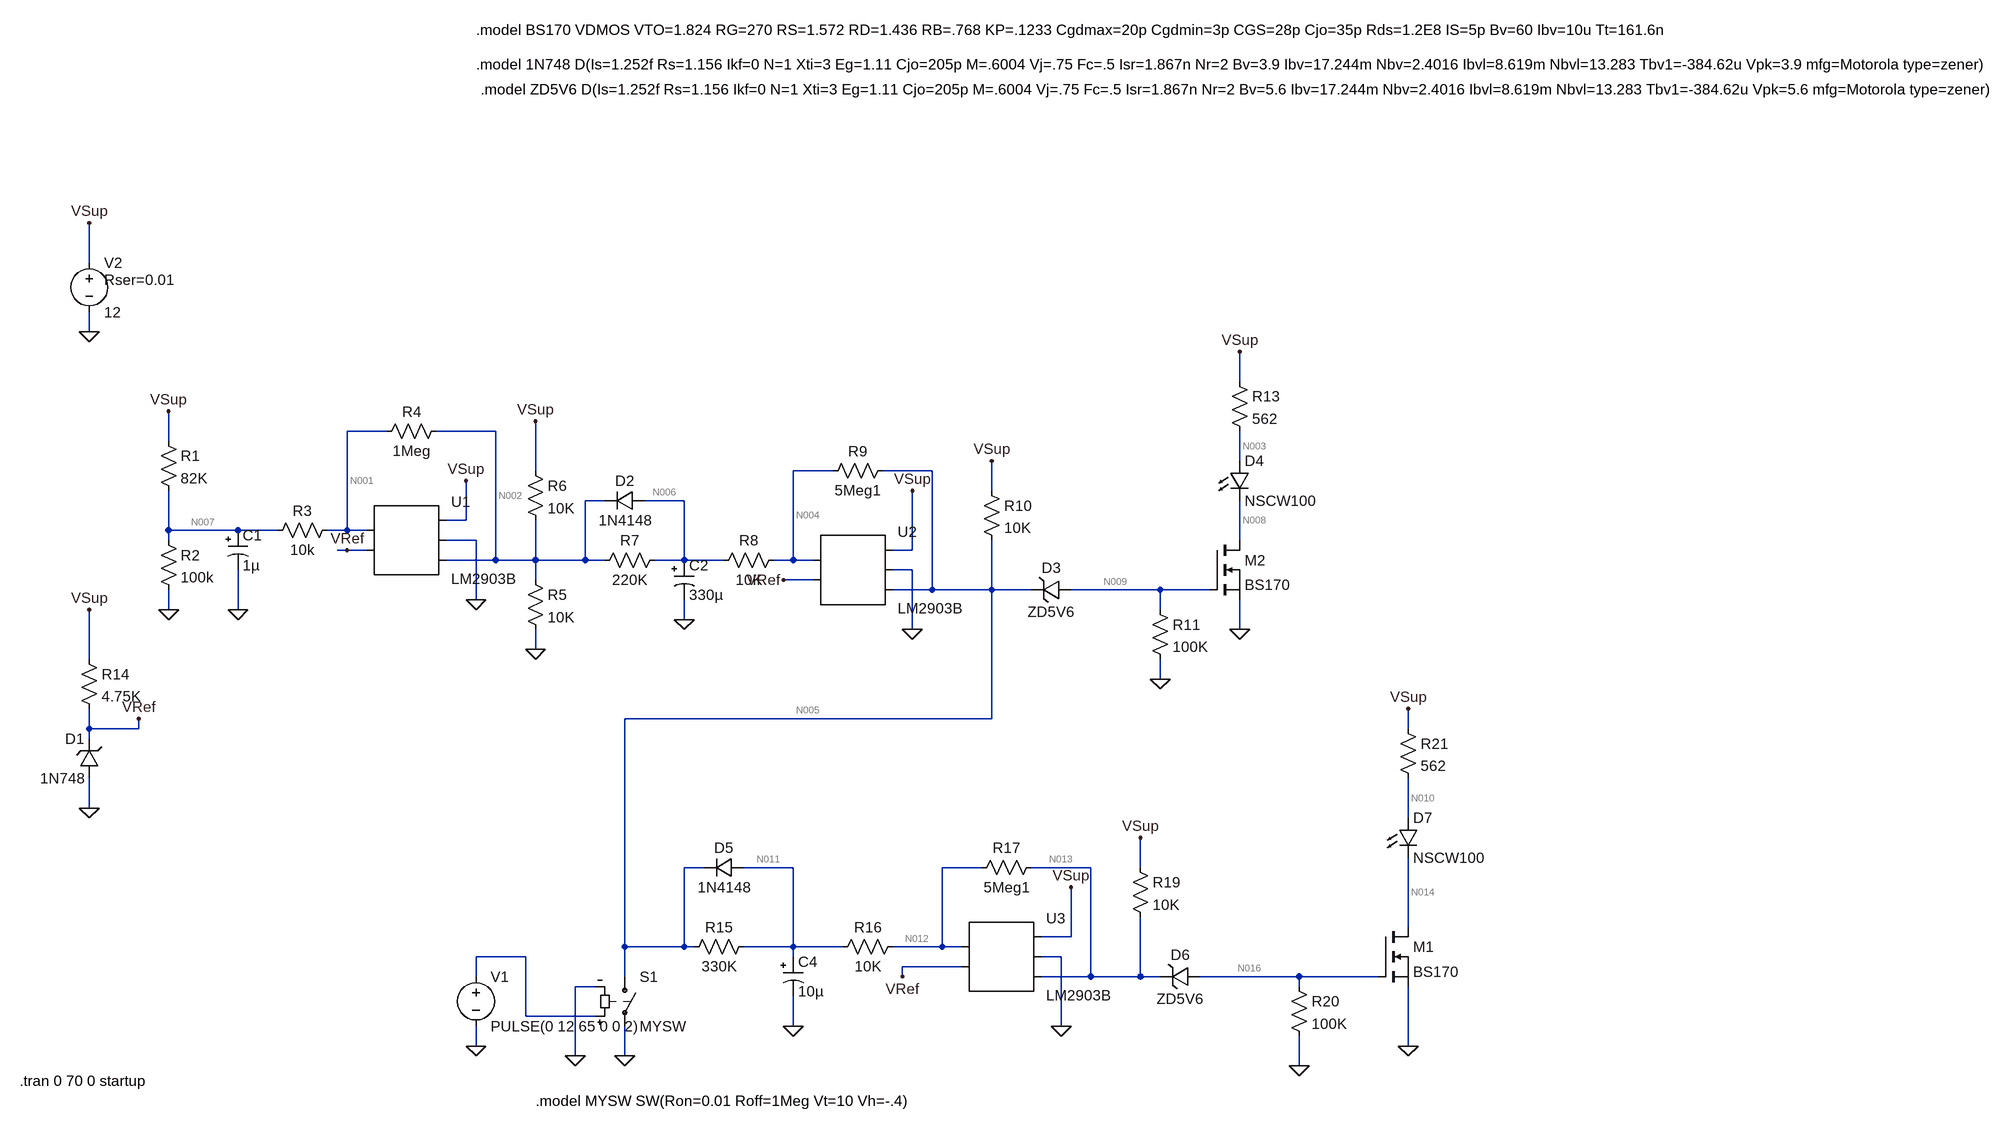
[diagram p0: schematic Delay.asc]
* Delay.asc
* U1: LM2903B (symbol AutoGenerated\LM2903B not available, pins judged from their places): pin1=N001 pin2=VRef pin3=VSup pin4=0 pin5=N002
* U2: LM2903B (symbol AutoGenerated\LM2903B not available, pins judged from their places): pin1=N004 pin2=VRef pin3=VSup pin4=0 pin5=N005
R1 VSup N007 82K tol=1 pwr=0.1
R2 N007 0 100k
C1 N007 0 1µ V=50 Irms=6.2m Rser=2.66795 Lser=851.833p mfg="Würth Elektronik" pn="865230640005 WCAP-AS5H 4x5,5" type="Al electrolytic"
R3 N001 N007 10k
V2 VSup 0 12 Rser=0.01
R4 N002 N001 1Meg tol=1 pwr=0.1
R5 N002 0 10K tol=1 pwr=0.1
R6 VSup N002 10K tol=1 pwr=0.1
R7 N006 N002 220K tol=1 pwr=0.1
C2 N006 0 330µ V=16 Irms=235m Rser=0.36 Lser=0
R8 N004 N006 10K tol=1 pwr=0.1
R9 N005 N004 5Meg1 tol=1 pwr=0.1
R10 VSup N005 10K tol=1 pwr=0.1
D2 N006 N002 1N4148
R13 VSup N003 562 tol=1 pwr=0.1
D4 N003 N008 NSCW100
D1 0 VRef 1N748
R14 VSup VRef 4.75K tol=1 pwr=0.1
* U3: LM2903B (symbol AutoGenerated\LM2903B not available, pins judged from their places): pin1=N012 pin2=VRef pin3=VSup pin4=0 pin5=N013
D5 N011 N005 1N4148
C4 N011 0 10µ V=25 Irms=235m Rser=0.46 Lser=0
R15 N011 N005 330K tol=1 pwr=0.1
R16 N012 N011 10K tol=1 pwr=0.1
R17 N013 N012 5Meg1 tol=1 pwr=0.25
R19 VSup N013 10K tol=1 pwr=0.1
R20 N016 0 100K tol=1 pwr=0.1
D7 N010 N014 NSCW100
R21 VSup N010 562 tol=1 pwr=0.1
M1 N014 N016 0 0 BS170
M2 N008 N009 0 0 BS170
D3 N009 N005 ZD5V6
D6 N016 N013 ZD5V6
R11 N009 0 100K tol=1 pwr=0.1
S1 N005 0 N015 0 MYSW
V1 N015 0 PULSE(0 12 65 0 0 2)
.model D D
.lib standard.dio
.model NMOS NMOS
.model PMOS PMOS
.lib standard.mos
.model BS170 VDMOS VTO=1.824 RG=270 RS=1.572 RD=1.436 RB=.768 KP=.1233 Cgdmax=20p Cgdmin=3p CGS=28p Cjo=35p Rds=1.2E8 IS=5p Bv=60 Ibv=10u Tt=161.6n
.model 1N748 D(Is=1.252f Rs=1.156 Ikf=0 N=1 Xti=3 Eg=1.11 Cjo=205p M=.6004 Vj=.75 Fc=.5 Isr=1.867n Nr=2 Bv=3.9 Ibv=17.244m Nbv=2.4016 Ibvl=8.619m Nbvl=13.283 Tbv1=-384.62u Vpk=3.9 mfg=Motorola type=zener)
.model ZD5V6 D(Is=1.252f Rs=1.156 Ikf=0 N=1 Xti=3 Eg=1.11 Cjo=205p M=.6004 Vj=.75 Fc=.5 Isr=1.867n Nr=2 Bv=5.6 Ibv=17.244m Nbv=2.4016 Ibvl=8.619m Nbvl=13.283 Tbv1=-384.62u Vpk=5.6 mfg=Motorola type=zener)
.tran 0 70 0 startup
.model MYSW SW(Ron=0.01 Roff=1Meg Vt=10 Vh=-.4)
.backanno
.end

* Results of the author's LTspice run, read from the files saved beside the schematic
* Operating Point, zero values left out:
*   V(vsup) = -16.5 µV
*   V(n002) = 114.8 nV
*   V(n001) = 174.1 µV
*   V(vref) = 33.32 µV
*   V(n005) = 109.9 nV
*   V(n004) = 761.8 µV
*   V(n007) = 140.8 µV
*   V(n006) = 728.3 µV
*   V(n003) = -16.5 µV
*   V(n008) = -14.66 µV
*   V(n013) = -88.41 nV
*   V(n012) = 1.097 mV
*   V(n011) = 1.064 mV
*   V(n016) = -336.8 pV
*   V(n010) = -16.5 µV
*   V(n014) = -14.66 µV
*   V(n009) = 418.8 pV
*   I(D1) = -11.03 pA
*   I(D5) = 59.88 pA
*   I(D2) = 40.82 pA
*   I(R19) = -1.641 nA
*   I(R17) = -215.2 pA
*   I(R16) = 3.285 nA
*   I(R15) = 3.225 nA
*   I(R14) = -10.49 nA
*   I(R10) = -1.661 nA
*   I(R9) = -149.3 pA
*   I(R8) = 3.351 nA
*   I(R7) = 3.31 nA
*   I(R6) = -1.661 nA
*   I(R5) = 11.48 pA
*   I(R4) = -173.9 pA
*   I(R3) = 3.326 nA
*   I(R2) = 1.408 nA
*   I(R1) = -1.918 nA
*   I(V2) = -1.65 mA
*   Ix(u1:IN+) = -3.5 nA
*   Ix(u1:IN-) = -3.5 nA
*   Ix(u1:VCC) = 550 µA
*   Ix(u1:GND) = -550 µA
*   Ix(u1:OUT) = 1.852 nA
*   Ix(u2:IN+) = -3.5 nA
*   Ix(u2:IN-) = -3.5 nA
*   Ix(u2:VCC) = 550 µA
*   Ix(u2:GND) = -550 µA
*   Ix(u2:OUT) = 1.773 nA
*   Ix(u3:IN+) = -3.5 nA
*   Ix(u3:IN-) = -3.5 nA
*   Ix(u3:VCC) = 550 µA
*   Ix(u3:GND) = -550 µA
*   Ix(u3:OUT) = -1.426 nA
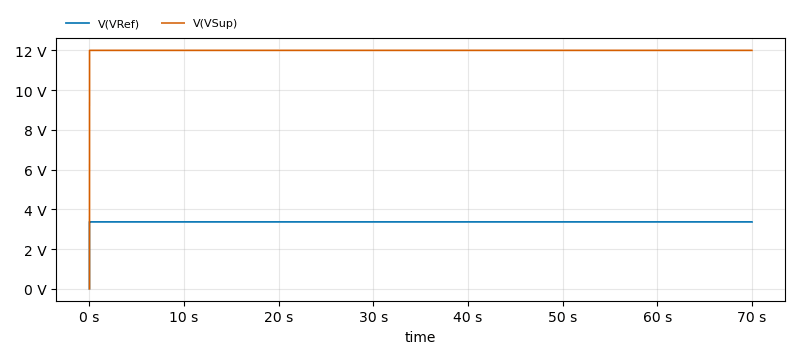
[diagram p1: Transient Analysis of Delay.asc, plotted from the saved traces]
* Transient Analysis, 1 run:
*   V(VRef): min 33.32 µV, max 3.367 V, average 3.367 V, rms 3.367 V, last 3.367 V
*   V(VSup): min -16.5 µV, max 12 V, average 12 V, rms 12 V, last 12 V